# EAGLE design schematic (EAGLE 9.0.1)
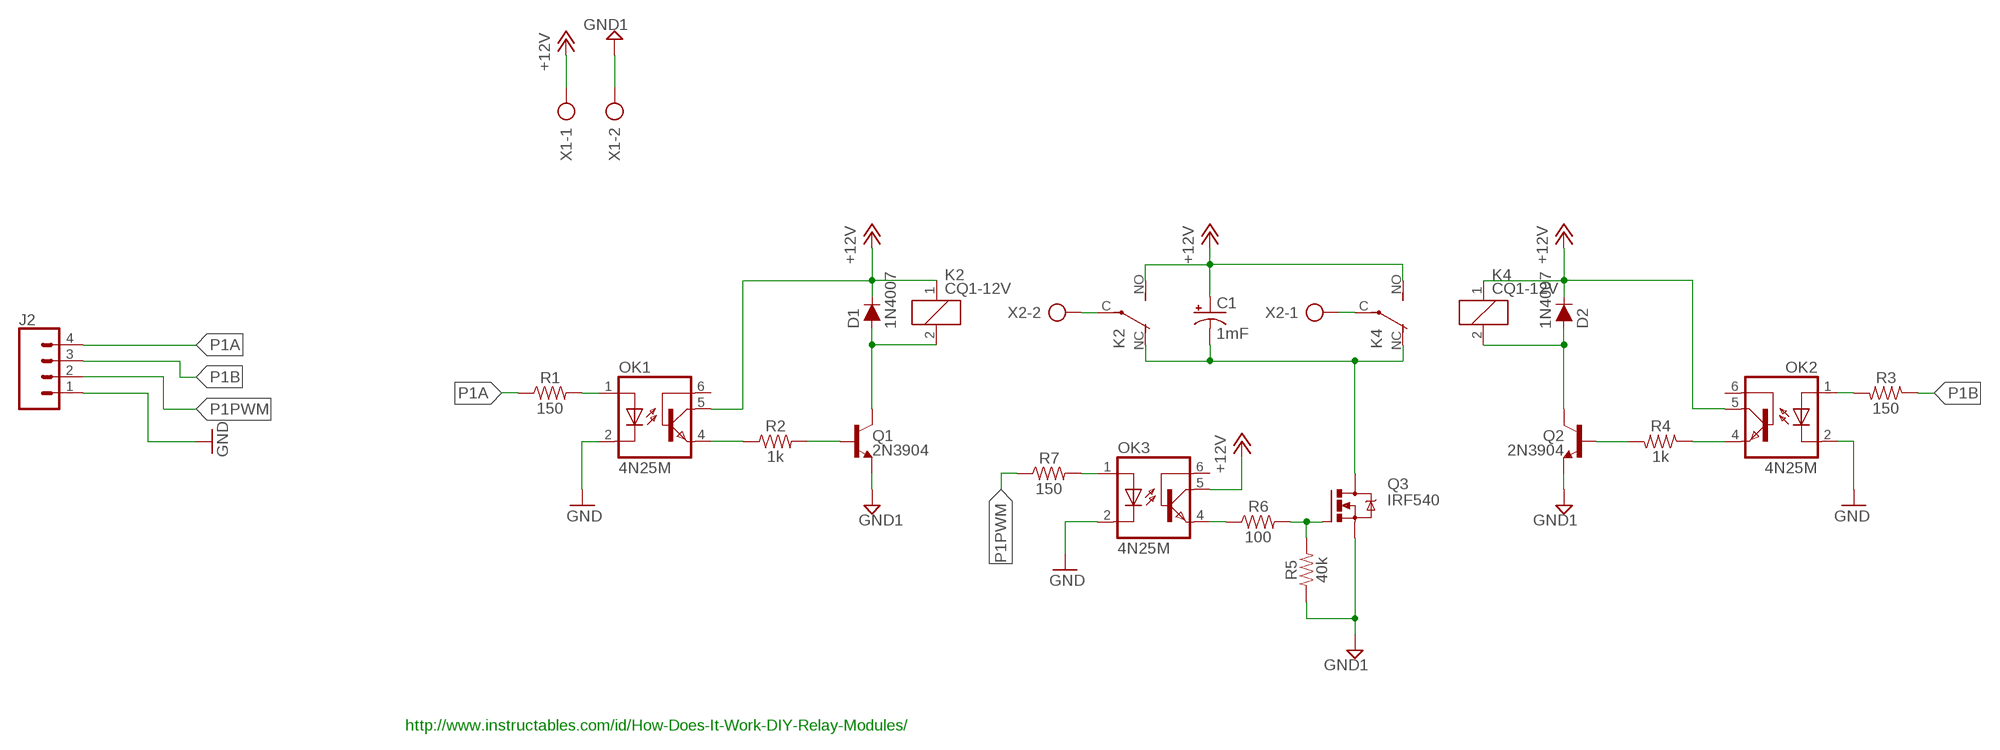
[diagram p0: schematic, sheet 1]

## Parts
C1  1mF  1000UF-RADIAL-5MM-25V-20%  [CPOL-RADIAL-5MM-10MM]
D1  1N4007  DIODE-PTH  [DIODE-1N4001]
D2  1N4007  DIODE-PTH  [DIODE-1N4001]
J2  CONN_04LOCK_LONGPADS  [1X04_LOCK_LONGPADS]
K2  CQ1-12V  [CQ1]
K4  CQ1-12V  [CQ1]
OK1  4N25M  [DIL06]
OK2  4N25M  [DIL06]
OK3  4N25M  [DIL06]
Q1  2N3904  TRANS_NPN-2N3904  [TO-92]
Q2  2N3904  TRANS_NPN-2N3904  [TO-92]
Q3  IRF540  [TO220BV]
R1  150  10KOHM-HORIZ-1/4W-1%  [AXIAL-0.3]
R2  1k  10KOHM-HORIZ-1/4W-1%  [AXIAL-0.3]
R3  150  10KOHM-HORIZ-1/4W-1%  [AXIAL-0.3]
R4  1k  10KOHM-HORIZ-1/4W-1%  [AXIAL-0.3]
R5  40k  10KOHM-HORIZ-1/4W-1%  [AXIAL-0.3]
R6  100  10KOHM-HORIZ-1/4W-1%  [AXIAL-0.3]
R7  150  10KOHM-HORIZ-1/4W-1%  [AXIAL-0.3]
X1  AK300/2  [AK300/2]
X2  AK300/2  [AK300/2]

## Nets
+12V: C1.+ D1.C D2.C K2.1 K2.NO(2:S) K4.1 K4.NO(2:S) OK1.5(COL) OK2.5(COL) OK3.5(COL) X1.1
GND: J2.1 OK1.2(C) OK2.2(C) OK3.2(C)
GND1: Q1.1(E) Q2.1(E) Q3.S R5.P$1 X1.2
N$1: Q1.2(B) R2.P$2
N$2: K4.C(2:P) X2.1
N$3: OK1.1(A) R1.P$2
N$4: K2.C(2:P) X2.2
N$5: D1.A K2.2 Q1.3(C)
N$6: OK2.1(A) R3.P$2
N$7: OK1.4(EMI) R2.P$1
N$8: D2.A K4.2 Q2.3(C)
N$9: OK2.4(EMI) R4.P$1
N$10: Q2.2(B) R4.P$2
N$11: C1.- K2.NC(2:O) K4.NC(2:O) Q3.D
N$12: OK3.4(EMI) R6.P$1
N$13: Q3.G R5.P$2 R6.P$2
N$15: OK3.1(A) R7.P$2
P1A: J2.4 R1.P$1
P1B: J2.3 R3.P$1
P1PWM: J2.2 R7.P$1
Unconnected: OK1.6(BAS) OK2.6(BAS) OK3.6(BAS)

## Notes on the sheet
- http://www.instructables.com/id/How-Does-It-Work-DIY-Relay-Modules/

## Library data of the parts
C1 = SparkFun-Capacitors:1000UF: 1,000µF/1mF ceramic capacitors A capacitor is a passive two-terminal electrical component used to store electrical energy temporarily in an electric field. CAP-08070; PROD_ID: CAP-09538
D1 D2 = SparkFun-DiscreteSemi:DIODE: Diode These are standard reverse protection diodes and small signal diodes. SparkFun Products: SparkFun SparkPunk Sound Kit <https://www.sparkfun.com/products/11177> SparkFun ESP8266 Thing <https://www.sparkfun.com/products/13231>; PROD_ID: DIO-09176; VALUE: 1A/50V/1.1V
J2 = SparkFun-Connectors:CONN_04: Multi connection point. Often used as Generic Header-pin footprint for 0.1 inch spaced/style header connections On any of the 0.1 inch spaced packages, you can populate with these: Break Away Headers - Straight <https://www.sparkfun.com/products/116> (PRT-00116) Break Away Male Headers - Right Angle <https://www.sparkfun.com/products/553> (PRT-00553) Female Headers <https://www.sparkfun.com/products/115> (PRT-00115) Break Away Headers - Machine Pin <https://www.sparkfun.com/products/117> (PRT-00117) Break Away Female Headers - Swiss Machine Pin <https://www.sparkfun.com/products/743> (PRT-00743) For SCREWTERMINALS and SPRING TERMINALS visit here: Screw Terimnals on SparkFun.com <https://www.sparkfun.com/search/results?term=Screw+Terminals> (5mm/3.5mm/2.54mm spacing) This device is also useful as a general connection point to wire up your design to another part of your project. Our various solder wires solder well into these plated through hole pads. Hook-Up Wire - Assortment (Stranded, 22 AWG) <https://www.sparkfun.com/products/11375> (PRT-11375) Hook-Up Wire - Assortment (Solid Core, 22 AWG) <https://www.sparkfun.com/products/11367> (PRT-11367) View the entire wire category on our website here <https://www.sparkfun.com/categories/141> Special notes: Molex polarized connector foot print use with SKU : PRT-08231 with associated crimp pins and housings. 1MM SMD Version SKU: PRT-10208; PROD_ID: CONN-09696
K2 K4 = relay:CQ1-12V: AUTOMOTIVE QUIET RELAY NAiS Source: http://www.mew-europe.com/.. en_ds_61208_0000.pdf; OC_FARNELL: unknown; OC_NEWARK: unknown
OK1-OK3 = optocoupler:4N*?M: General Purpose 6-Pin Phototransistor Optocouplers Source: http://www.fairchildsemi.com/ds/4N/4N35-M.pdf; MPN: 4N25-M; OC_FARNELL: 1021349; OC_NEWARK: 98K9084
Q1 Q2 = SparkFun-DiscreteSemi:TRANS_NPN: NPN transistor Current controlled devices typically used to amplify current or used as a switch. BC547 - COM-08928 <http://www.sparkfun.com/products/8928> (TO-92 45V 100mA) (1.Collector 2.Base 3.Emitter) 2N3904 - COM-00521 <http://www.sparkfun.com/products/521> (TO-92 40V 200mA) (1.Emitter 2.Base 3.Collector) P2N2222A - COM-12852 <http://www.sparkfun.com/products/12852> (TO-92 40V 600mA) (1.Collector 2.Base 3.Emitter); PROD_ID: TRANS-08447; VALUE: 200mA/40V
Q3 = transistor-power:IRF540: HEXFET Power MOSFET
R1-R7 = SparkFun-Resistors:10KOHM: 10kΩ resistor A resistor is a passive two-terminal electrical component that implements electrical resistance as a circuit element. Resistors act to reduce current flow, and, at the same time, act to lower voltage levels within circuits. - Wikipedia; PROD_ID: RES-12183; VALUE: 10k
X1 X2 = con-ptr500:AK300/2: CONNECTOR; OC_FARNELL: unknown; OC_NEWARK: unknown

## Board
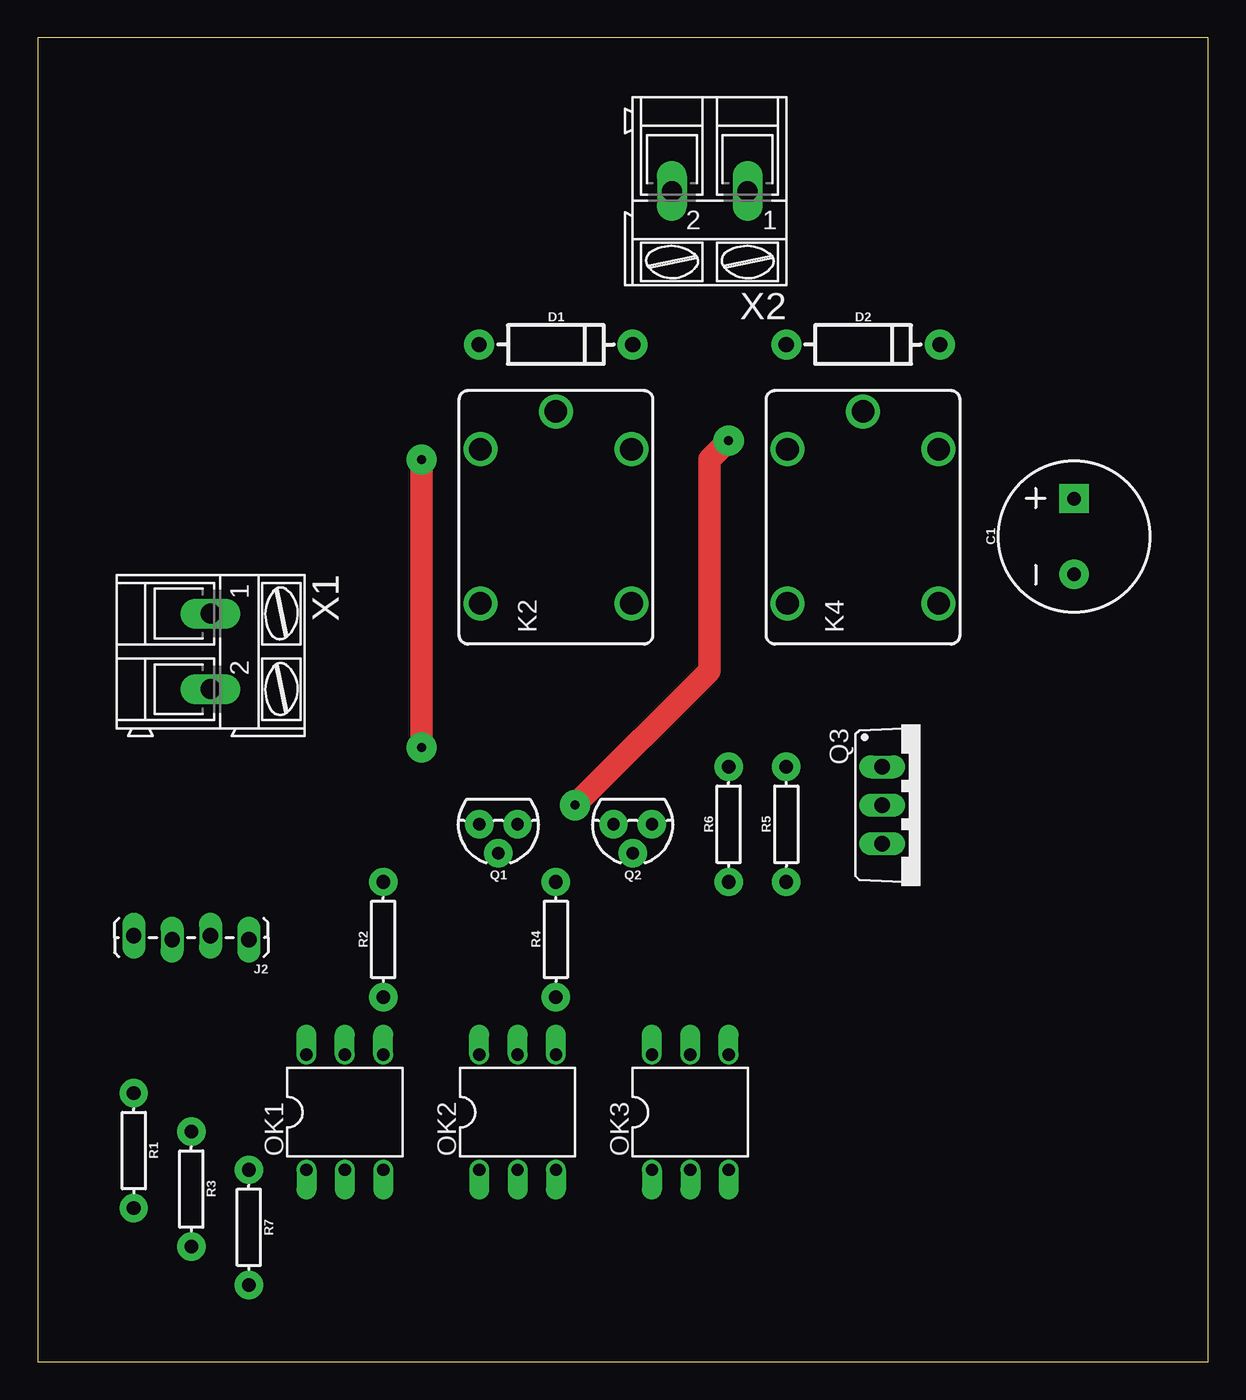
[diagram p1: board, top side]
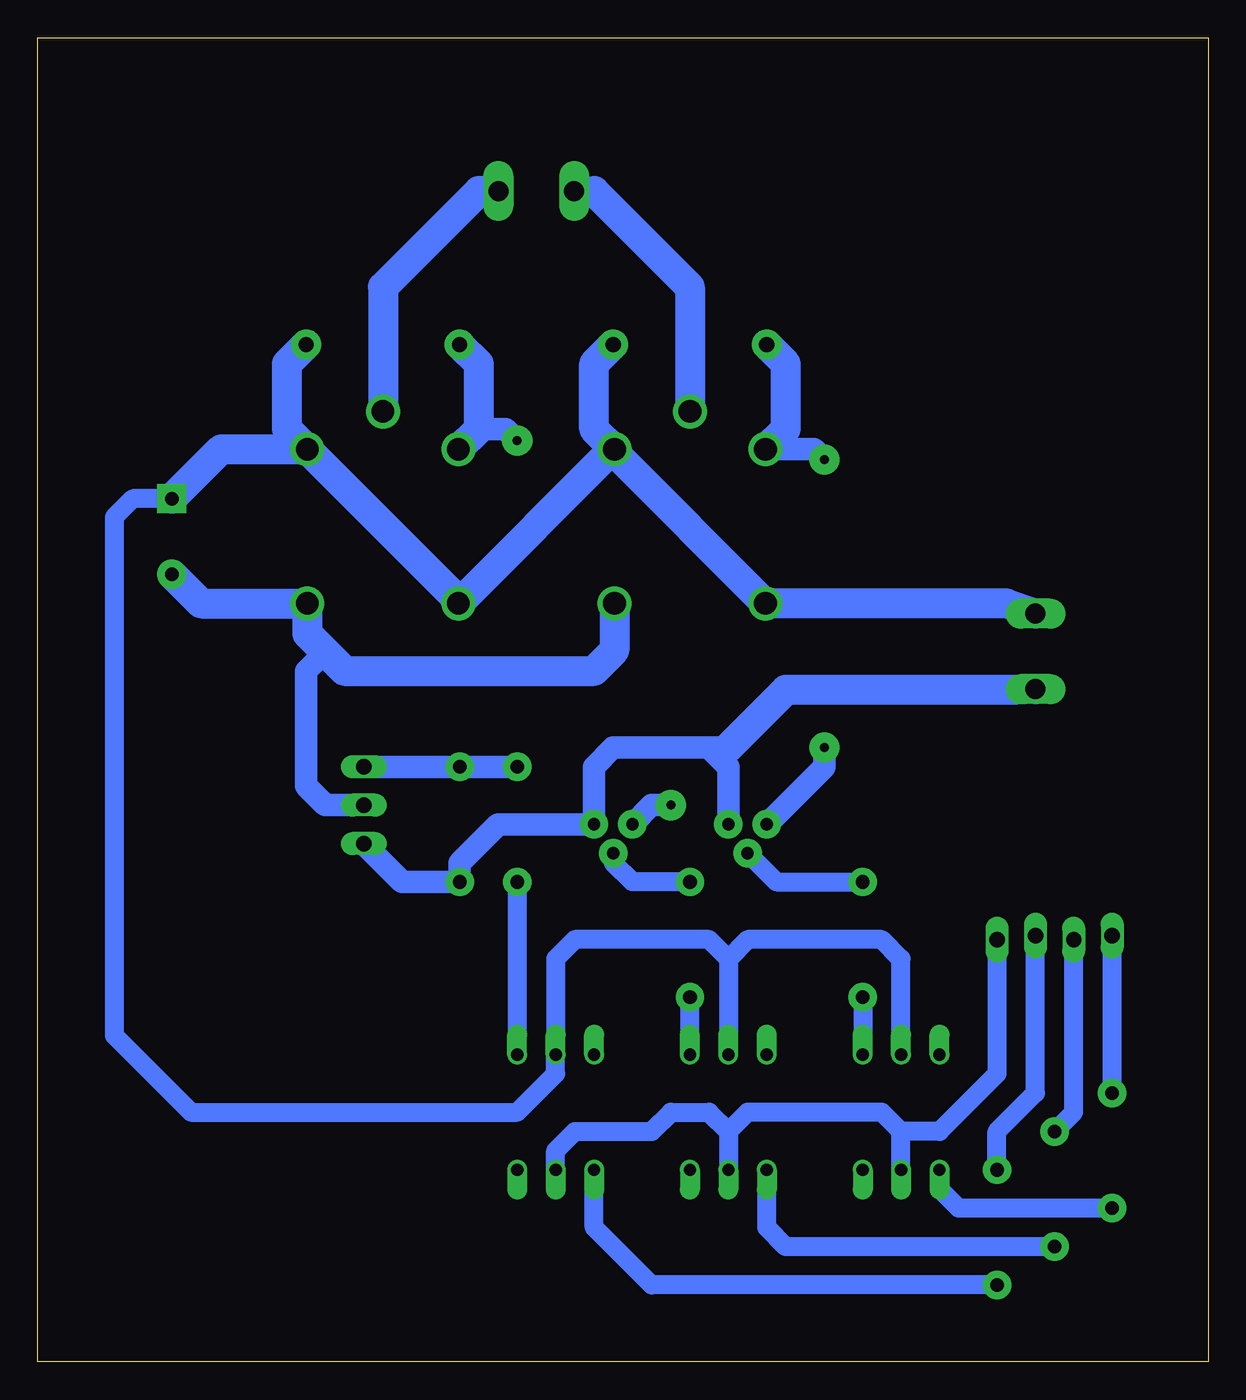
[diagram p2: board, bottom side, seen from below]

Size 77.45 x 87.61 mm. Coordinates in mm from the lower left corner, seen from the top.
Outline: 0,0 77.45,0 77.45,87.61 0,87.61 0,0
Copper layers (1*16): Top 0.035mm / dielectric 1.5mm / Bottom 0.035mm
Design rules "default": minimum track width 6mil, minimum drill 0.35mm, track to track 6mil, track to pad 6mil, pad to pad 6mil, via to via 6mil, smd to smd 6mil, copper to edge 40mil, drill to drill 6mil, minimum pad ring 10mil, minimum via ring 8mil, stop-mask expansion 4mil, vias tented up to drill 0mil, thermal gap 10mil

### Footprints (pad centres in the part's own frame; a part is rotated, then mirrored left to right if it is on the bottom)
CPOL-RADIAL-5MM-10MM = drill 0.9 pad 1.93 square: + 2.5,0 | drill 0.9 pad 1.93: - -2.5,0
DIODE-1N4001 = drill 1 pad 1.981: A -5.08,0; C 5.08,0
1X04_LOCK_LONGPADS = drill 1.016 long: 1 0,0; 2 2.54,-0.254; 3 5.08,0; 4 7.62,-0.254
CQ1 = drill 1.5: 1 4.5,-5; 2 4.5,5; C 7,0; NC -5.7,-5; NO -5.7,5
DIL06 = drill 0.813 offset: 1 -2.54,-3.81; 2 0,-3.81; 3 2.54,-3.81; 4 2.54,3.81; 5 0,3.81; 6 -2.54,3.81
TO-92 = drill 0.813 pad 1.88: 1 -1.27,0; 2 0,1.905; 3 1.27,0
TO220BV = drill 1.016 long: D 0,-2.54; G -2.54,-2.54; S 2.54,-2.54
AXIAL-0.3 = drill 0.9 pad 1.88: P$1 -3.81,0; P$2 3.81,0
AK300/2 = drill 1.321 long: 1 -2.515,0; 2 2.489,0

### Placement (x,y rotation side)
C1  68.58,54.61 90 top
D1  34.29,67.31 0 top
D2  54.61,67.31 0 top
J2  13.97,27.94 180 top
K2  34.29,55.88 90 top
K4  54.61,55.88 90 top
OK1  20.32,16.51 0 top
OK2  31.75,16.51 0 top
OK3  43.18,16.51 0 top
Q1  30.48,35.56 180 top
Q2  39.37,35.56 180 top
Q3  58.42,36.83 270 top
R1  6.35,13.97 270 top
R2  22.86,27.94 90 top
R3  10.16,11.43 270 top
R4  34.29,27.94 90 top
R5  49.53,35.56 90 top
R6  45.72,35.56 90 top
R7  13.97,8.89 270 top
X1  11.43,46.99 270 top
X2  44.45,77.47 180 top

### Tracks (layer width: path | path; a pad name or v marks a point on that pad's centre or on a via)
+12V
  Bottom 1.27: OK1.5 20.32,26.67 21.59,27.94 30.48,27.94 31.75,26.67 | 31.75,26.67 OK2.5 | 31.75,26.67 33.02,27.94 41.91,27.94 43.18,26.67 OK3.5 43.18,19.05 45.72,16.51 67.31,16.51 72.39,21.59 72.39,55.88 71.16,57.11 C1.+
  Bottom 2: K2.1 40.64,61.73 40.64,66.04 D1.C | K4.1 60.96,61.73 60.96,66.04 D2.C | K4.1 49.61,50.38 K4.NO 39.41,60.38 K2.1 | K2.1 39.29,60.18 K2.NO 13.38,50.18 X1.1 | C1.+ 65.31,60.38 K4.1
GND
  Bottom 1.27: OK1.2 20.32,15.24 | 20.32,15.24 21.59,16.51 30.48,16.51 31.75,15.24 | 31.75,15.24 OK2.2 | 31.75,15.24 33.02,16.51 35.56,16.51 36.83,15.24 41.91,15.24 43.18,13.97 OK3.2 | J2.1 13.97,19.05 17.78,15.24 20.32,15.24
GND1
  Bottom 1.5: Q3.S 53.34,31.75 R5.P$1 49.53,33.02 46.99,35.56 Q2.1 40.64,39.37 39.37,40.64 33.02,40.64 | 33.02,40.64 31.75,39.37 Q1.1 | 31.75,40.64 33.02,40.64
  Bottom 2: X1.2 12.75,44.45 27.94,44.45 31.75,40.64
N$1
  Bottom 1.27: Q1.2 28.57,31.75 R2.P$2
N$2
  Bottom 2: X2.1 48.26,77.47 54.61,71.12 K4.C
N$3
  Bottom 1.27: OK1.1 17.78,11.43 16.51,10.16 R1.P$2
N$4
  Bottom 2: X2.2 40.64,77.47 34.29,71.12 K2.C
N$5  (via drill 0.6 pad 2)
  Top 1.5: v25.4,40.64 v25.4,59.69
  Bottom 1.5: v25.4,59.69 26.09,60.38 K2.2 | Q1.3 25.4,39.37 v25.4,40.64
  Bottom 2: K2.2 27.94,61.73 27.94,66.04 D1.A
N$6
  Bottom 1.27: R3.P$2 27.94,7.62 29.21,8.89 OK2.1
N$7
  Bottom 1.27: R2.P$1 OK1.4
N$8  (via drill 0.6 pad 2)
  Top 1.5: v35.56,36.83 44.45,45.72 44.45,59.69 v45.72,60.96
  Bottom 1.5: Q2.3 36.83,36.83 v35.56,36.83 | v45.72,60.96 46.49,61.73 48.26,61.73
  Bottom 2: K4.2 48.26,61.73 48.26,66.04 D2.A
N$9
  Bottom 1.27: OK2.4 R4.P$1
N$10
  Bottom 1.27: R4.P$2 38.1,31.75 39.37,33.02 Q2.2
N$11
  Bottom 1.5: Q3.D 58.42,36.83 59.69,38.1 59.69,45.72 58.42,46.99
  Bottom 2: K2.NC 39.29,47.07 40.64,45.72 57.15,45.72 58.42,46.99 59.61,48.18 K4.NC 66.65,50.18 C1.-
N$12
  Bottom 1.27: R6.P$1 OK3.4
N$13
  Bottom 1.5: Q3.G R5.P$2 R6.P$2
N$15
  Bottom 1.27: OK3.1 40.64,8.89 36.83,5.08 R7.P$2
P1A
  Bottom 1.27: R1.P$1 J2.4
P1B
  Bottom 1.27: R3.P$1 8.89,16.51 J2.3
P1PWM
  Bottom 1.27: R7.P$1 13.97,15.24 11.43,17.78 J2.2